# Altium schematic sheet relay_blk.SchDoc
size A4; Engineer: JBayalas; DocumentNumber: 11; Revision: V4.3.0; SheetNumber: 11; SheetTotal: 12
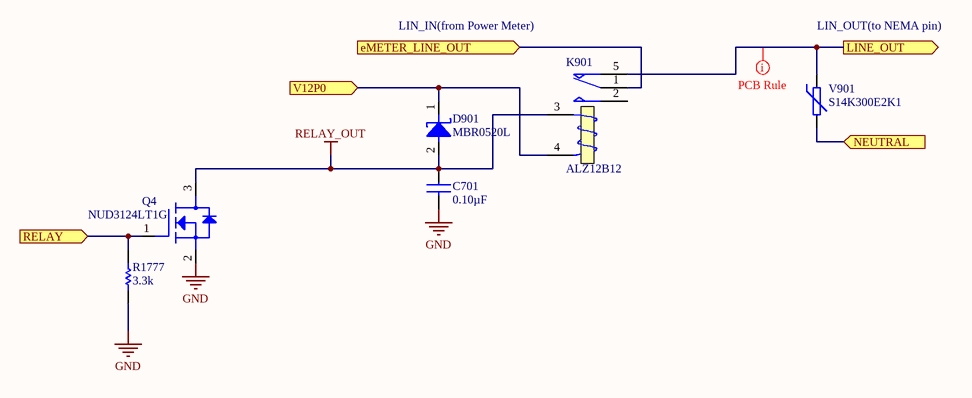
[diagram p0: relay_blk.SchDoc]

## Parts
C701  value 0.10µF  [C0402]  (hidden comment: GRM155R71H104ME14D)
D901  MBR0520L  [SOD123]
K901  ALZ12B12  [ALZ12B12 (custom)]
Q4  NUD3124LT1G  [SOT-23-3]
R1777  value 3.3k  [R0402]  (hidden comment: CRCW04023K30FKED)
V901  S14K300E2K1  [S14K300E2K1]

## Ports
eMETER_LINE_OUT (in), LINE_OUT (out), NEUTRAL (in), RELAY (in), V12P0 (in)

## Nets
GND: C701.2 Q4.2(source) R1777.1
RELAY_OUT: C701.1 D901.2(anode) K901.3(T1) Q4.3(drain)
eMETER_LINE_OUT: K901.1(COM) ; port eMETER_LINE_OUT
LINE_OUT: K901.5(NC) V901.2 ; port LINE_OUT
NEUTRAL: V901.1 ; port NEUTRAL
RELAY: Q4.1(gate) R1777.2 ; port RELAY
V12P0: D901.1(cathode) K901.4(T2) ; port V12P0

Not connected (* = marked no-connect by the designer): K901 2(NO)

## Layout directives
rule Clearance Constraint [Clearance = 1.7mm]: LINE_OUT

## Notes on the sheet
- (near K901) LIN_IN(from Power Meter)
- LIN_OUT(to NEMA pin)
- Title:
- Sheet:
- Date:
- of
- Project:
- Revision:
- Engineer:
- WI4B S.r.l

## Library data of the parts
C701 = GRM155R71H104ME14D: CAP CER 0.1UF 50V X7R 0402; MFT: Murata Electronics North America; TYPE: SMD; FUNCTION: Relay; MPN: GRM155R71H104ME14D; RATING: 50V; DNP: *
D901 = MBR0520L: DIODE SCHOTTKY 20V 0.5A SOD123; ALT MPN1: B0520W; MFT: ON Semiconductor; TYPE: SMD; RATING: 20V 500MA; ALT DESC1: DIODE SCHOTTKY 20V 0.5A SOD123 B0520W; ALT MFT1: Bytesonic; FUNCTION: Relay; MPN: MBR0520L; VALUE: MBR0520L
K901 = ALZ12B12: General Purpose Relays 16A 12VDC SPDT CLASS B; ALT MPN2: HF115F/012-1ZS3A; ALT MPN1: RZ03-1C4-D012; MFT: Panasonic Industrial Devices; ALT DESC2: Miniatrure High Power Relay HF115F/012-1ZS3A; ALT DESC1: RELAY GEN PURPOSE SPDT 16A 12V; ALT MFT2: Hongfa; ALT MFT1: TE connectivity; FUNCTION: Relay; VALUE: ALZ12B12; TYPE: Through Hole; MPN: ALZ12B12
Q4 = NUD3124LT1G: IC INDCT LOAD DRVR AUTO SOT23; MFT: ON Semiconductor; TYPE: Surface Mount; FUNCTION: Relay; VALUE: NUD3124LT1G; MPN: NUD3124LT1G
R1777 = CRCW04023K30FKED: RES SMD 3.3K OHM 1% 1/16W 0402; MFT: Vishay Dale; FUNCTION: Relay; MPN: CRCW04023K30FKED; TYPE: SMD; RATING: 1/16W; DNP: *
V901 = S14K300E2K1: VARISTOR 470V 6KA DISC 14MM; ALT MPN1: SVR14D471KA78BH; MFT: EPCOS (TDK); ALT MFT1: Fenghua Hi Tech; ALT DESC1: 14D 470V 6KVA/3KVA 6000A(8/20us) Bulk SVR14D471KA78BH; FUNCTION: Relay; VALUE: S14K300E2K1; TYPE: TH; RATING: 470V; MPN: S14K300E2K1; LOAD: *; APN: *